# EAGLE design SMC-DCc5 (EAGLE 8.2.2)
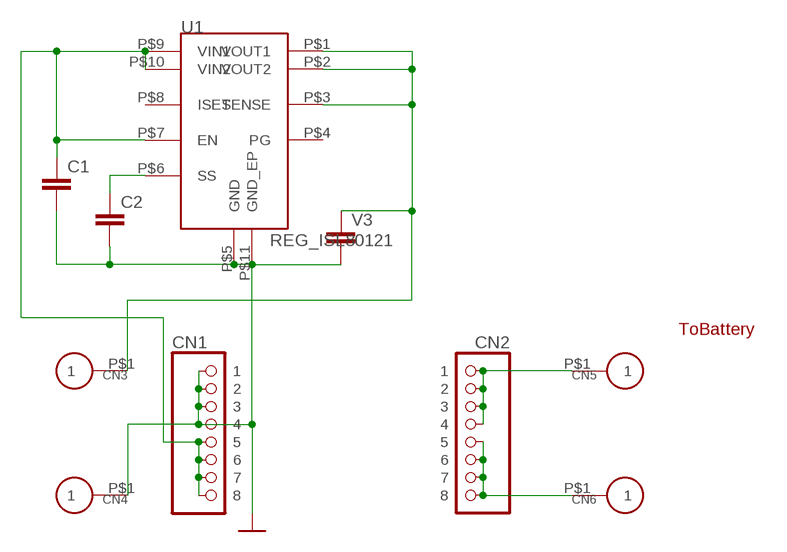
[diagram p0: schematic, sheet 1]

## Parts
C1  CAP0603  [0603]
C2  CAP0603  [0603]
CN1  CON_PINHD-1X8FPC05  [CON_8P_FPC05MM]
CN2  CON_PINHD-1X8FPC05  [CON_8P_FPC05MM]
CN3  CON_P01SMD1MM  [PAD_SMD1MM]
CN4  CON_P01SMD1MM  [PAD_SMD1MM]
CN5  CON_P01SMD1MM  [PAD_SMD1MM]
CN6  CON_P01SMD1MM  [PAD_SMD1MM]
U1  REG_ISL80121  [DFN10_0.5MM]
V3  CAP1206  [1206]

## Nets
GND: C1.2 C2.2 CN1.P$1 CN1.P$2 CN1.P$3 CN1.P$4 CN4.P$1 U1.P$5(GND) U1.P$11(GND_EP) V3.P$2 ; supply symbol labelled POW_GND
N$2: CN2.P$5 CN2.P$6 CN2.P$7 CN2.P$8 CN6.P$1
N$3: C2.1 U1.P$6(SS)
N$5: CN2.P$1 CN2.P$2 CN2.P$3 CN2.P$4 CN5.P$1
P1: C1.1 CN1.P$5 CN1.P$6 CN1.P$7 CN1.P$8 U1.P$7(EN) U1.P$9(VIN1) U1.P$10(VIN2)
P1O: CN3.P$1 U1.P$1(VOUT1) U1.P$2(VOUT2) U1.P$3(SENSE) V3.P$1
Unconnected: U1.P$4(PG) U1.P$8(ISET)

## Notes on the sheet
- ToBattery

## Library data of the parts
C1 C2 V3 = akita:CAP: Capacitor Standard 0603 ceramic capacitor, and 0.1" leaded capacitor.
CN1 CN2 = akita:CON_PINHD-1X8: PIN HEADER
CN3-CN6 = akita:CON_P01
U1 = akita:REG_ISL80121: Intersil's LDO, ISL80121

## Board
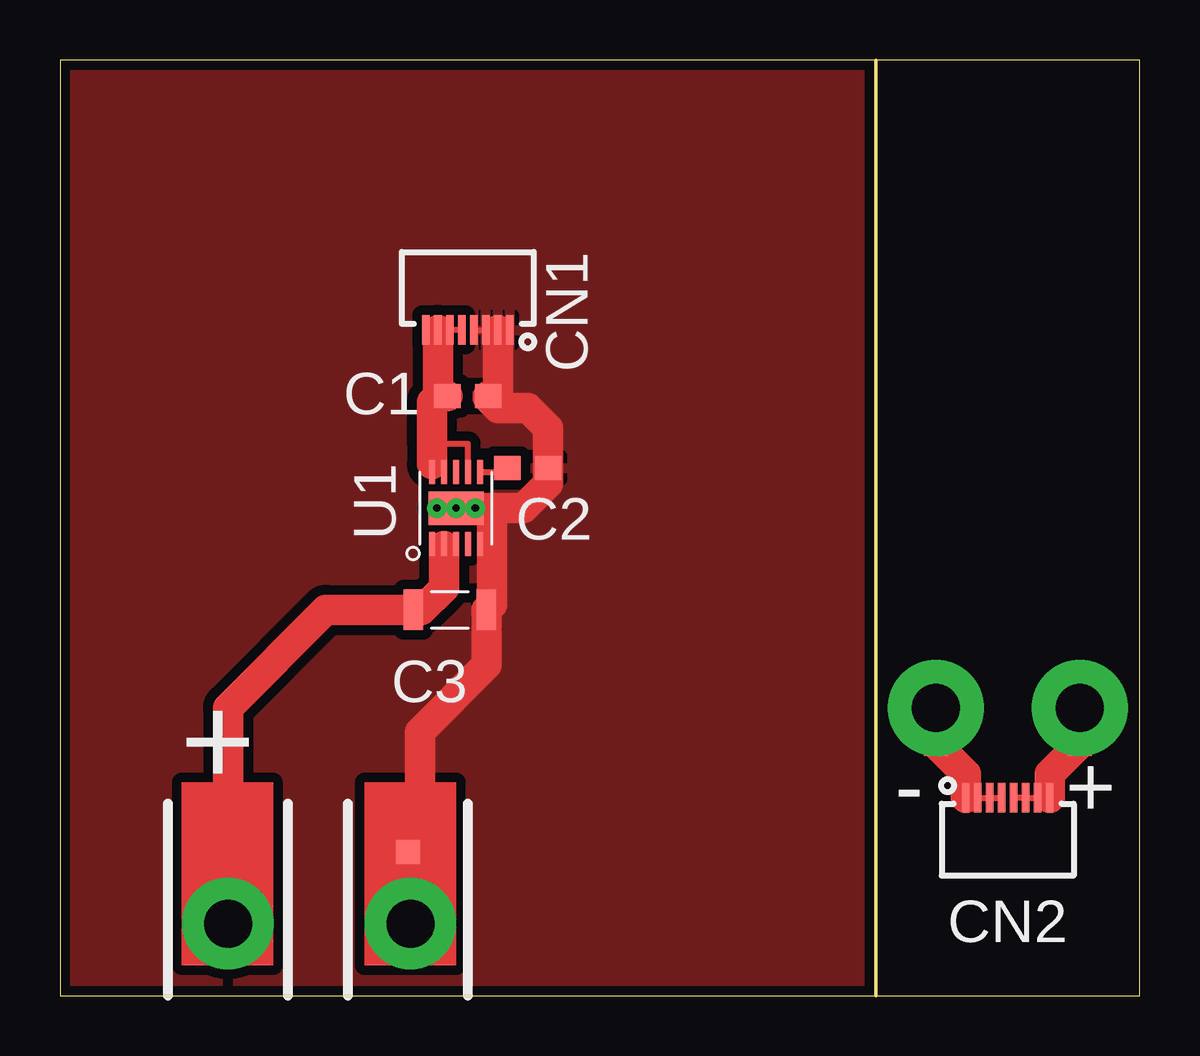
[diagram p1: board, top side]
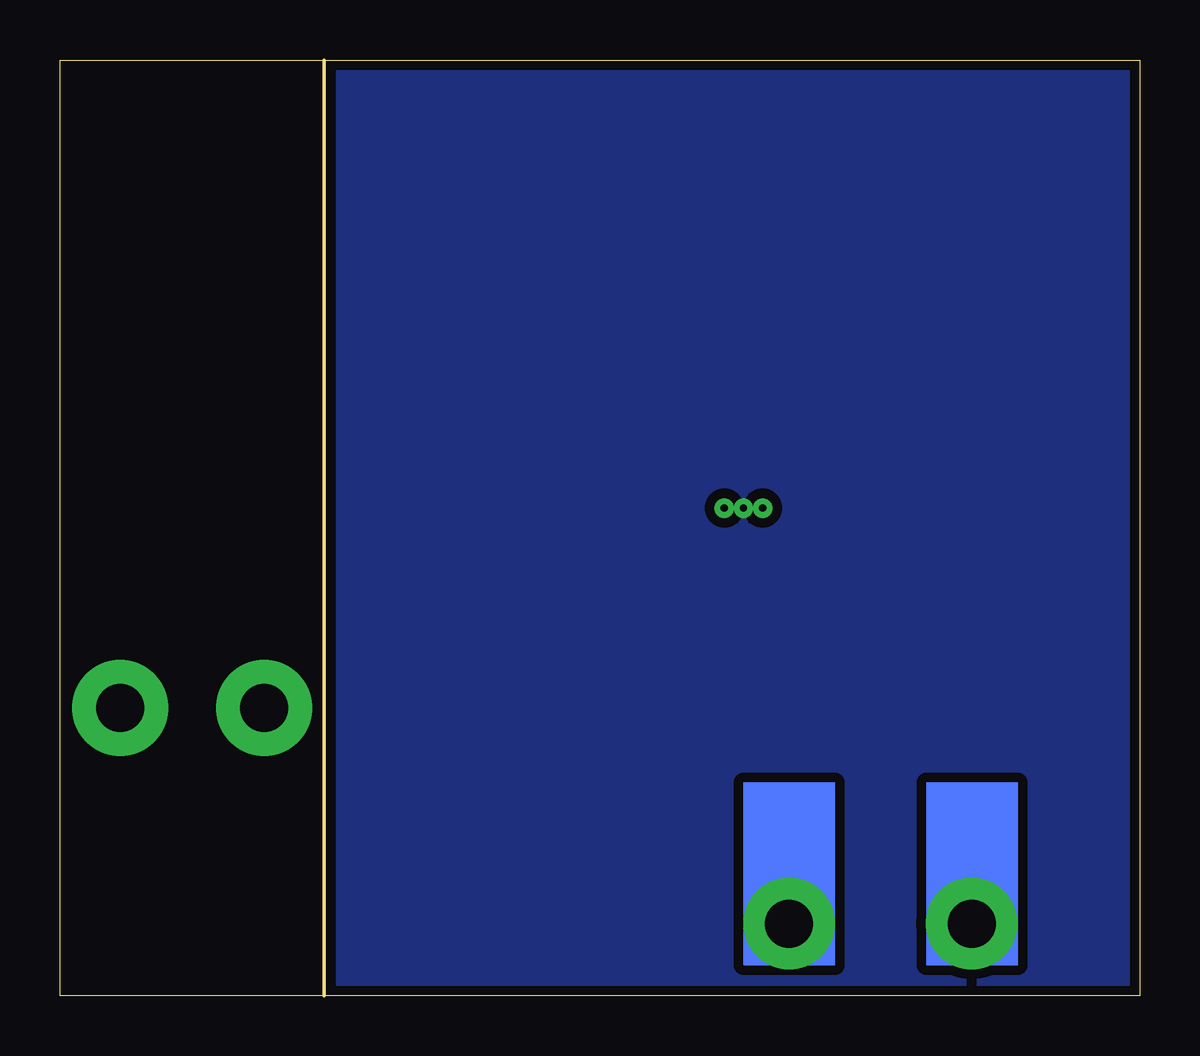
[diagram p2: board, bottom side, seen from below]

Size 45 x 39 mm. Coordinates in mm from the lower left corner, seen from the top.
Outline: 34,0 0,0 0,39 34,39
Outline: 34,0 45,0 45,39 34,39
Outline: 34,39 34,0
Copper layers (1*16): Top 0.035mm / dielectric 1.5mm / Bottom 0.035mm
Design rules "SeeedStudio_2layer_DRU_no_angle_20140221_Drill03mm": minimum track width 6mil, minimum drill 0.3mm, track to track 6mil, track to pad 6mil, pad to pad 6mil, via to via 6mil, smd to smd 0mil, copper to edge 10mil, drill to drill 10mil, minimum pad ring 10mil, minimum via ring 6mil, stop-mask expansion 2mil, vias tented up to drill 100mil, thermal gap 10mil

### Footprints (pad centres in the part's own frame; a part is rotated, then mirrored left to right if it is on the bottom)
0603 = smd 1.1 x 1: 1 -0.85,0; 2 0.85,0
CON_8P_FPC05MM = smd 0.3 x 1.21: P$1 -1.75,0.25; P$2 -1.25,0.25; P$3 -0.75,0.25; P$4 -0.25,0.25; P$5 0.25,0.25; P$6 0.75,0.25; P$7 1.25,0.25; P$8 1.75,0.25
PAD_SMD1MM = smd 1 x 1: P$1 0,0
DFN10_0.5MM = smd 1 x 0.25: P$1 -1.5,1; P$2 -1.5,0.5; P$3 -1.5,0; P$4 -1.5,-0.5; P$5 -1.5,-1; P$6 1.5,-1; P$7 1.5,-0.5; P$8 1.5,0; P$9 1.5,0.5; P$10 1.5,1 | drill 0.3 pad 0.406: P$11 0,0; P$12 0,0.8; P$13 0,-0.8 | smd 1.4 x 2.3: P$14 0,0
1206 = smd 0.813 x 1.676: P$1 -1.524,0; P$2 1.524,0

### Placement (x,y rotation side)
C1  17,25 0 top
C2  19.5,22 0 top
CN1  17,28 180 top
CN2  39.5,8 0 top
CN3  7,3 0 top
CN4  14.5,6 0 top
CN5  36.5,10.5 0 top
CN6  42.5,10.5 0 top
U1  16.51,20.32 90 top
V3  16.25,16.08 0 top

### Tracks (layer width: path | path; a pad name or v marks a point on that pad's centre or on a via)
GND  (via drill 2 pad 3.81)
  Top 0.254: CN1.P$4 CN1.P$3 CN1.P$2 CN1.P$1 | U1.P$5 17.89,18.82 18,18.71 | CN4.P$1 14.5,4.5 15,4
  Top 1.27: CN1.P$2 18.25,24.5 | C1.2 17.85,24.9 18.25,24.5 | 18.25,24.5 19.5,24.5 20.35,23.65 C2.2 20.35,21.35 19.32,20.32 17.68,20.32 | U1.P$11 17.68,20.32 | 17.68,20.32 18,20 18,18.71 18,16.31 V3.P$2 17.77,13.77 15,11 15,4 v14.61,3
  pour Top (isolate 0.406): 0,39 45,39 45,0 0,0
  pour Bottom (isolate 0.406): 0,39 45,39 45,0 0,0
N$1  (via drill 2 pad 4)
  other vias: 42.5,12
N$2
  Top 0.254: CN2.P$8 CN2.P$7 CN2.P$6 CN2.P$5
  Top 1.27: CN2.P$8 41.25,9.25 CN6.P$1
N$3
  Top 0.254: U1.P$6 18.47,21.82 C2.1
N$4  (via drill 2 pad 4)
  other vias: 36.5,12
N$5
  Top 0.254: CN2.P$4 CN2.P$3 CN2.P$2 CN2.P$1
  Top 1.27: CN2.P$1 37.75,9.25 CN5.P$1
P1
  Top 0.254: CN1.P$8 CN1.P$7 CN1.P$6 CN1.P$5 | U1.P$9 U1.P$10 15.51,22.14 15.5,22.15 | U1.P$7 17.01,22.99 17,23 15.58,23 15.5,23.08
  Top 1.27: 15.75,24.97 CN1.P$7 | 15.5,22.15 15.5,23.08 15.5,24.75 15.75,24.97 | C1.1 15.78,25 15.75,24.97
P1O  (via drill 2 pad 3.81)
  Top 0.254: U1.P$1 15.93,18.82 16,18.75 16.01,18.76 | U1.P$3 16.07,18.82 16.01,18.76 | U1.P$2 16.01,18.76
  Top 1.27: CN3.P$1 7,12 11.08,16.08 V3.P$1 15.08,16.08 16,17 16,18.75
  other vias: 7,3
(copper drawn outside any net)
  shapes: Bottom area x2, Top area x2

### Text on the board
tPlace: C1 | CN1 | U1 | C2 | C3 | - | + | + | CN2